# EasyEDA Pro project ProProject_Hauptplatine_ESP32.epro, schematic Schematic1_kombi
Create Date: 2024-06-13; Page Name: P1; Project Name: Hauptplatine_ESP32; Schematic Name: Schematic1_kombi; Update Date: 2024-06-16; Company: EasyEDA.com; Drawn: EasyEDA; Page Size: A4; Part Number: JLCPCB-002; Reviewed: EasyEDA; Version: V0.1
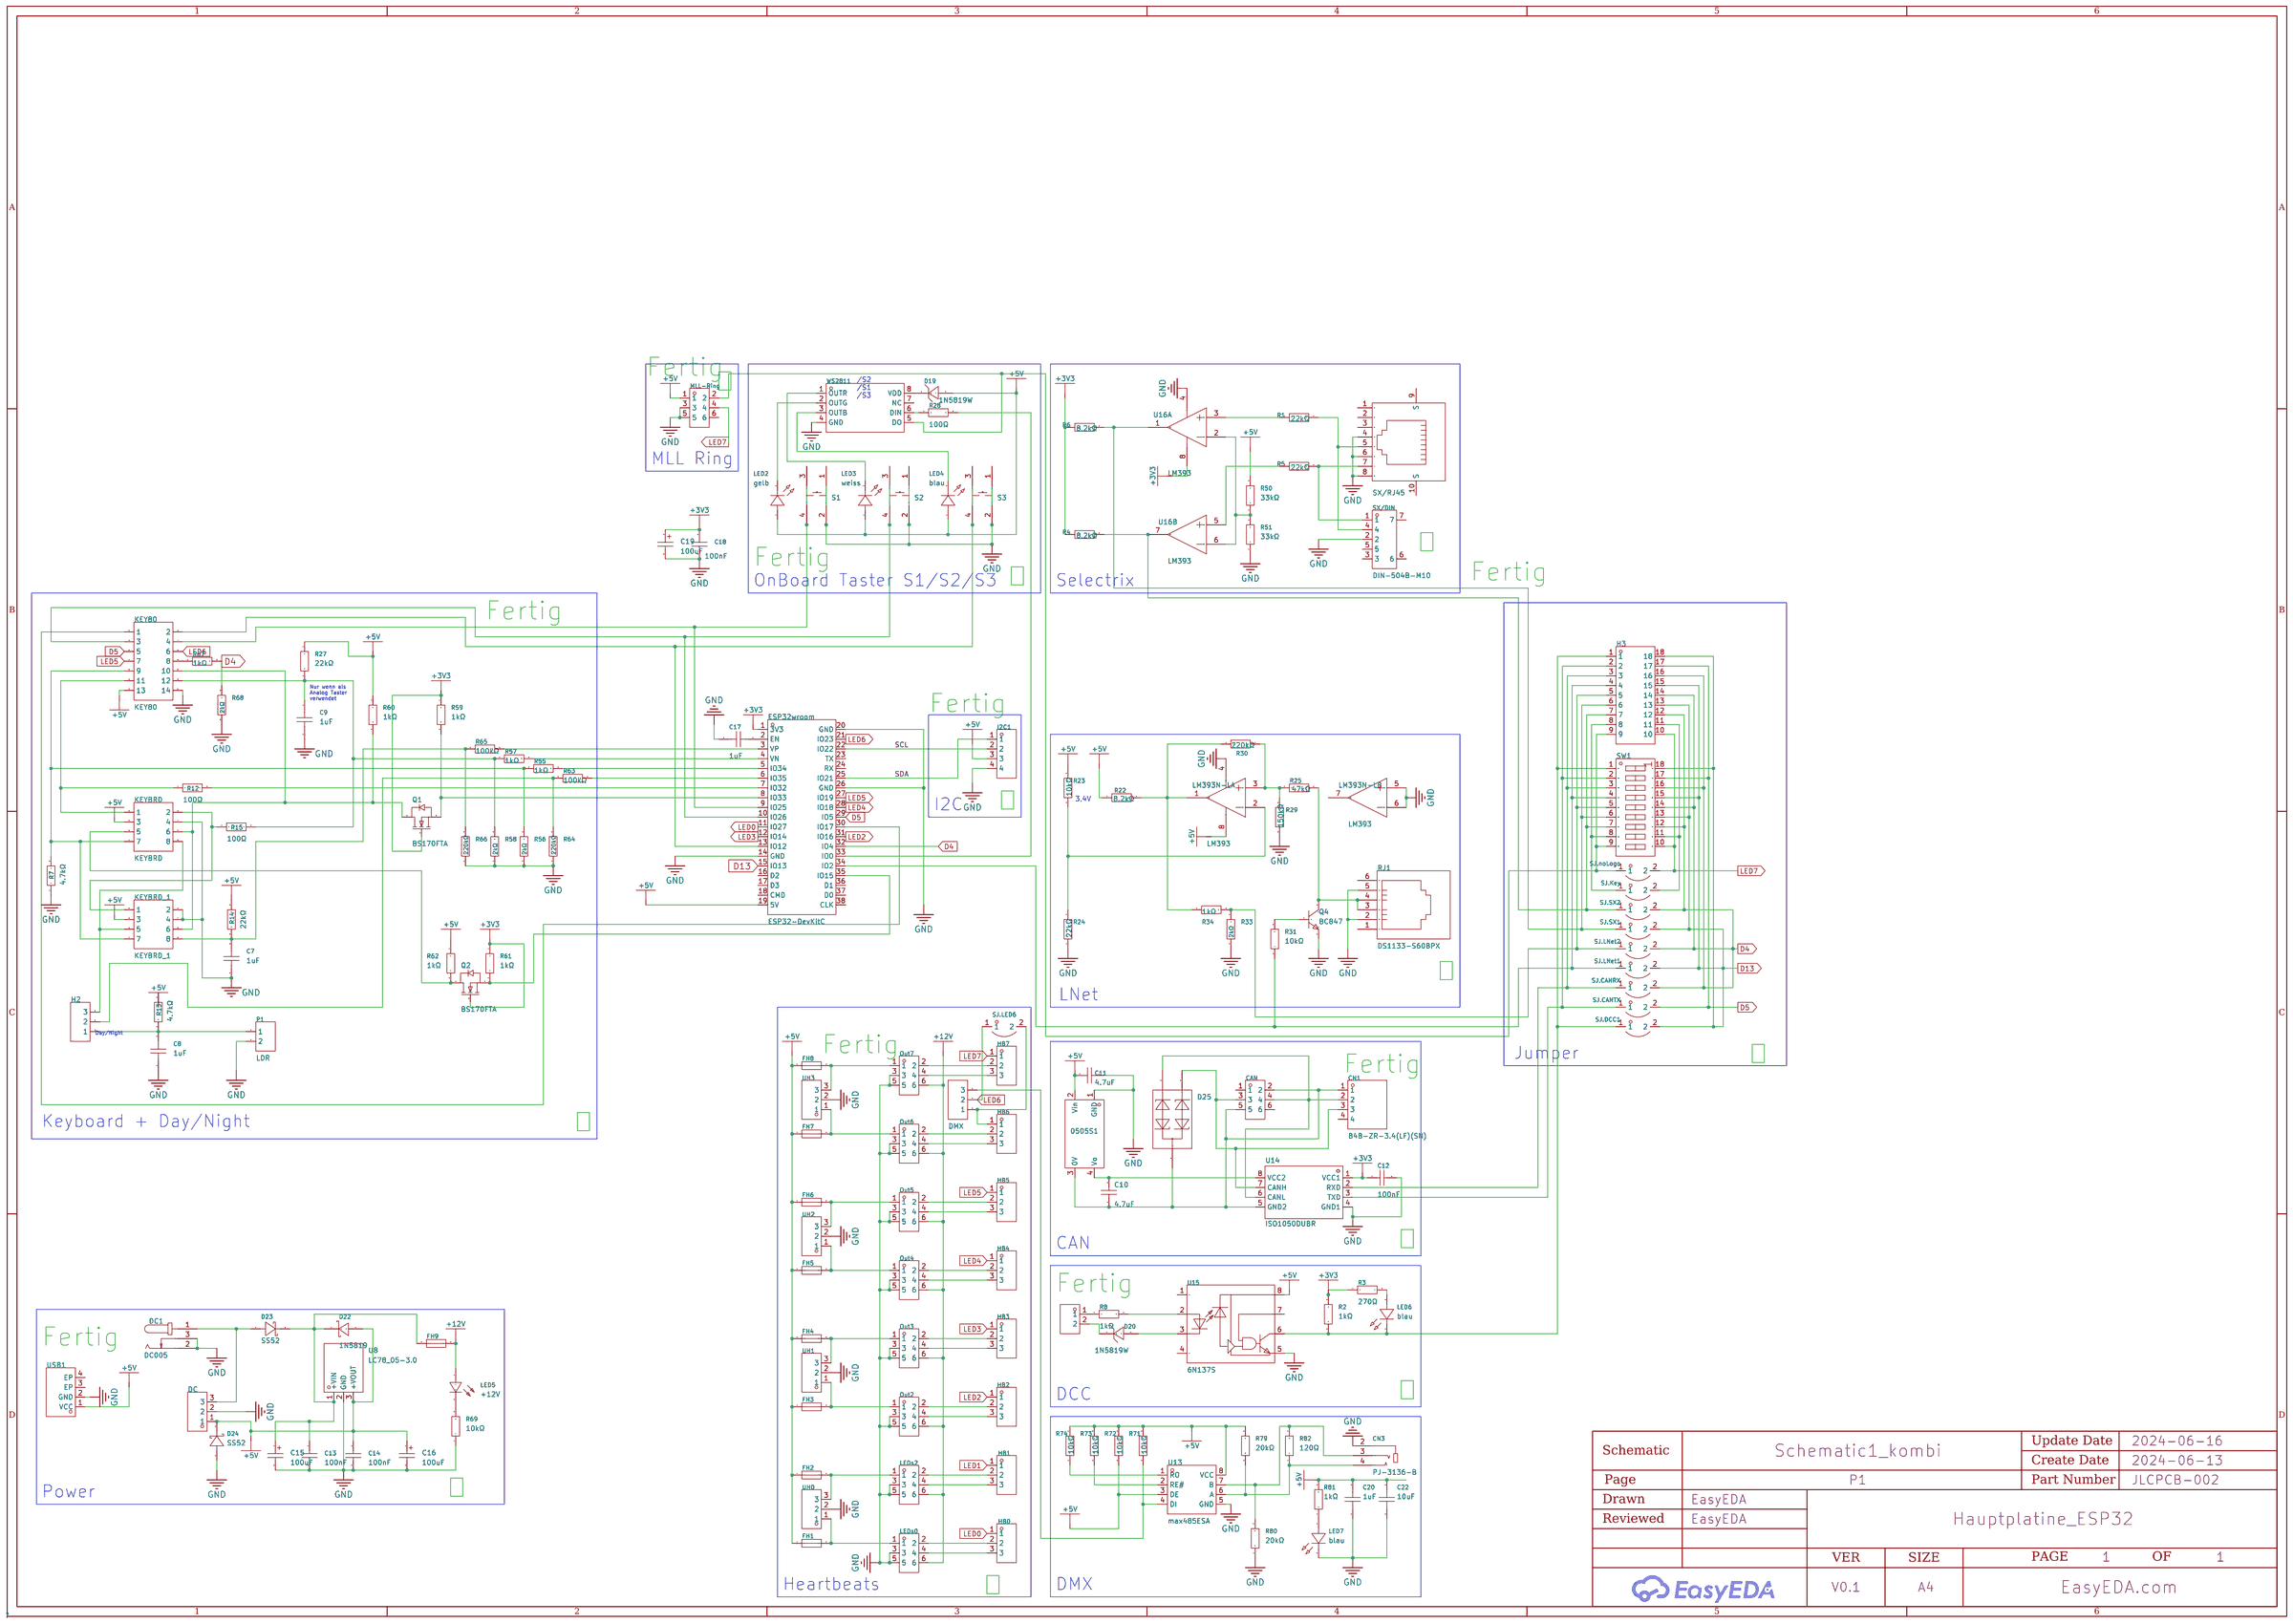
[diagram p5: schematic sheet]

## Parts
0505S1  B0505S-W5R3  [PWRM-TH_BXXXXS-1WR3]
C7  1uF  [C1206]
C8  1uF  [C1206]
C9  1uF  [C1206]
C10  4.7uF  [C1206]
C11  4.7uF  [C1206]
C12  100nF  [C1206]
C13  100nF  [C1206]
C14  100nF  [C1206]
C15  100uF  [CASE-D_7343]
C16  100uF  [CAP-SMD_L3.5-W2.8-R-RD]
C17  1uF  [C1206]
C18  100nF  [C1206]
C19  100uF  [CAP-SMD_L3.5-W2.8-R-RD]
C20  1uF  [C1206]
C22  10uF  [C1206]
CAN  BH254V-6P  [IDC-TH_6P-P2.54-V-R2-C3-S2.54]
CN1  B4B-ZR-3.4(LF)(SN)  [CONN-TH_B4B-ZR-3.4-LF-SN]
CN3  PJ-3136-B  [AUDIO-TH_PJ-3136-B]
D19  1N5819W  [SOD-123_L2.8-W1.8-LS3.7-RD]
D20  1N5819W  [SOD-123_L2.8-W1.8-LS3.7-RD]
D22  1N5819  [SMA_L4.4-W2.6-LS5.0-RD]
D23  SS52  [SMA_L4.3-W2.6-LS5.1-R-RD]
D24  SS52  [SMA_L4.3-W2.6-LS5.1-R-RD]
D25  PESD2CAN,215  [SOT-23-3_L2.9-W1.3-P1.90-LS2.4-BR]
DC  DB2ERC-3.5-3P-GN  [CONN-TH_3P-P3.50_DB2ERC-3.5-3P-GN]
DC1  DC005  [DC-IN-TH_DC005]
DCC1  DB2ERC-3.5-2P-GN  [CONN-TH_2P-P3.50_DB2ERC-3.5-2P]
DMX  2.54-1*3P针  [HDR-TH_3P-P2.54-V-M-1]
ESP32wroom  ESP32-DevKitC  [BULETM-SMD_ESP32-DEVKITC]
FH1  01550900M  [FUSE-SMD_L9.8-W5.0]
FH2  01550900M  [FUSE-SMD_L9.8-W5.0]
FH3  01550900M  [FUSE-SMD_L9.8-W5.0]
FH4  01550900M  [FUSE-SMD_L9.8-W5.0]
FH5  01550900M  [FUSE-SMD_L9.8-W5.0]
FH6  01550900M  [FUSE-SMD_L9.8-W5.0]
FH7  01550900M  [FUSE-SMD_L9.8-W5.0]
FH8  01550900M  [FUSE-SMD_L9.8-W5.0]
FH9  01550900M  [FUSE-SMD_L9.8-W5.0]
H2  2.54-1*3P针  [HDR-TH_3P-P2.54-V-M-1]
H3  X6521WV-2x09H-C60D30  [HDR-TH_18P-P2.54-V-M-R2-C9-S2.54]
HB0  PM2.54-1*3  [HDR-TH_3P-P2.54-V-F]
HB1  PM2.54-1*3  [HDR-TH_3P-P2.54-V-F]
HB2  PM2.54-1*3  [HDR-TH_3P-P2.54-V-F]
HB3  PM2.54-1*3  [HDR-TH_3P-P2.54-V-F]
HB4  PM2.54-1*3  [HDR-TH_3P-P2.54-V-F]
HB5  PM2.54-1*3  [HDR-TH_3P-P2.54-V-F]
HB6  PM2.54-1*3  [HDR-TH_3P-P2.54-V-F]
HB7  PM2.54-1*3  [HDR-TH_3P-P2.54-V-F]
I2C1  2.54-1*4P母  [HDR-TH_4P-P2.54-V-F]
KEY80  KEY80  [IDC-TH_14P-P2.54-V-R2-C7-S2.54]
KEYBRD  KEYBRD  [IDC-TH_8P-P2.54-V-R2-C4-S2.54]
KEYBRD_1  KEYBRD_1  [IDC-TH_8P-P2.54-V-R2-C4-S2.54]
LED2  gelb  [LED-TH_BD3.0-P2.54-FD_YELLOW]
LED3  weiss  [LED-TH_BD3.8-P2.54-FD_WHITE]
LED4  blau  [LED-TH_BD3.8-P2.54-FD_BLUE]
LED5  +12V  [LED-TH_BD3.0-P2.54-FD-GREEN]
LED6  blau  [LED-TH_BD3.8-P2.54-FD_BLUE]
LED7  blau  [LED-TH_BD3.8-P2.54-FD_BLUE]
LEDs0  BH254V-6P  [IDC-TH_6P-P2.54-V-R2-C3-S2.54]
LEDs2  BH254V-6P  [IDC-TH_6P-P2.54-V-R2-C3-S2.54]
LM393N-L  LM393  [SOP-8_L4.9-W3.9-P1.27-LS6.0-BL]  (sections 1,2)
MLL-Ring  BH254V-6P  [IDC-TH_6P-P2.54-V-R2-C3-S2.54]
Out2  BH254V-6P  [IDC-TH_6P-P2.54-V-R2-C3-S2.54]
Out3  BH254V-6P  [IDC-TH_6P-P2.54-V-R2-C3-S2.54]
Out4  BH254V-6P  [IDC-TH_6P-P2.54-V-R2-C3-S2.54]
Out5  BH254V-6P  [IDC-TH_6P-P2.54-V-R2-C3-S2.54]
Out6  BH254V-6P  [IDC-TH_6P-P2.54-V-R2-C3-S2.54]
Out7  BH254V-6P  [IDC-TH_6P-P2.54-V-R2-C3-S2.54]
P1  LDR  [HDR-TH_2P-P2.54-V-F]
Q1  BS170FTA  [SOT-23_L2.9-W1.3-P1.90-LS2.4-BR]
Q2  BS170FTA  [SOT-23_L2.9-W1.3-P1.90-LS2.4-BR]
Q4  BC847  [SOT-23-3_L2.9-W1.3-P1.90-LS2.4-BR]
R1  22kΩ  [R1206]
R2  1kΩ  [R1206]
R3  270Ω  [R1206]
R4  8.2kΩ  [R1206]
R5  22kΩ  [R1206]
R6  8.2kΩ  [R1206]
R7  4.7kΩ  [R1206]
R8  1kΩ  [R1206]
R12  100Ω  [R1206]
R13  4.7kΩ  [R1206]
R14  22kΩ  [R1206]
R15  100Ω  [R1206]
R22  8.2kΩ  [R1206]
R23  10kΩ  [R1206]
R24  22kΩ  [R1206]
R25  47kΩ  [R1206]
R27  22kΩ  [R1206]
R28  100Ω  [R1206]
R29  150kΩ  [R1206]
R30  220kΩ  [R1206]
R31  10kΩ  [R1206]
R33  2kΩ  [R1206]
R34  1kΩ  [R1206]
R50  33kΩ  [R1206]
R51  33kΩ  [R1206]
R55  1kΩ  [R1206]
R56  2kΩ  [R1206]
R57  1kΩ  [R1206]
R58  2kΩ  [R1206]
R59  1kΩ  [R1206]
R60  1kΩ  [R1206]
R61  1kΩ  [R1206]
R62  1kΩ  [R1206]
R63  100kΩ  [R1206]
R64  220kΩ  [R1206]
R65  100kΩ  [R1206]
R66  220kΩ  [R1206]
R67  1kΩ  [R1206]
R68  2kΩ  [R1206]
R69  10kΩ  [R1206]
R71  10kΩ  [R1206]
R72  10kΩ  [R1206]
R73  10kΩ  [R1206]
R74  10kΩ  [R1206]
R79  20kΩ  [R1206]
R80  20kΩ  [R1206]
R81  1kΩ  [R1206]
R82  120Ω  [R1206]
RJ1  DS1133-S60BPX  [RJ11-TH_DS1133-S60BPX]
S1  K2-1102DP-X4SW-04  [KEY-TH_4P-L6.2-W6.2-P4.50-LS6.5]
S2  K2-1102DP-X4SW-04  [KEY-TH_4P-L6.2-W6.2-P4.50-LS6.5]
S3  K2-1102DP-X4SW-04  [KEY-TH_4P-L6.2-W6.2-P4.50-LS6.5]
SJ.CANRX  SJ_1.27  [SMD_2P-P1.27-SJ]
SJ.CANTX  SJ_1.27  [SMD_2P-P1.27-SJ]
SJ.DCC1  SJ_1.27  [SMD_2P-P1.27-SJ]
SJ.Key  SJ_1.27  [SMD_2P-P1.27-SJ]
SJ.LED6  SJ_1.27  [SMD_2P-P1.27-SJ]
SJ.LNet1  SJ_1.27  [SMD_2P-P1.27-SJ]
SJ.LNet2  SJ_1.27  [SMD_2P-P1.27-SJ]
SJ.noLogo  SJ_1.27  [SMD_2P-P1.27-SJ]
SJ.SX1  SJ_1.27  [SMD_2P-P1.27-SJ]
SJ.SX2  SJ_1.27  [SMD_2P-P1.27-SJ]
SW1  DS-09RP  [SW-TH_18P-L24.4-W9.9-P2.54-LS7.6]
SX/DIN  DIN-504B-M10  [CONN-TH_DIN-504B-M10]
SX/RJ45  R-RJ45R08P-B000  [RJ45-TH_R-RJ45R08P-B000]
U8  LC78_05-3.0  [PWRM-TH_LC78_05-3.0]
U13  max485ESA  [SOP-8_L4.9-W3.9-P1.27-LS6.0-BL]
U14  ISO1050DUBR  [SOIC-8_L9.3-W6.6-P2.54-LS10.4-BL]
U15  6N137S  [SOP-8_L9.8-W6.6-P2.54-LS10.3-BL]
U16  LM393  [SOP-8_L4.9-W3.9-P1.27-LS6.0-BL]  (sections 1,2)
UH0  PM2.54-1*3  [HDR-TH_3P-P2.54-V-F]
UH1  PM2.54-1*3  [HDR-TH_3P-P2.54-V-F]
UH2  PM2.54-1*3  [HDR-TH_3P-P2.54-V-F]
UH3  PM2.54-1*3  [HDR-TH_3P-P2.54-V-F]
USB1  KH-TYPE-C-2P  [USB-SMD_KH-TYPE-C-2P]
WS2811  WS2811  [SOP-8_L4.9-W3.9-P1.27-LS6.0-BL]

## Library data of the parts
0505S1 = B0505S-W5R3: Conversion Type:DC-DC Input Voltage(DC):5V Input Voltage(DC):5V Output Voltage:5V Output Voltage:5V Output Power:0.5W Output Current (Max):100mA Output Current (Max):100mA Isolation or not:隔离 Output Channel:1 Insulated Voltage:1500V Conversion Efficiency:; LCSC Part Name: 电源模块; Supplier Part: C882275; Manufacturer: VISOM; Supplier Footprint: 插件; JLCPCB Part Class: Extended Part; Datasheet: https://atta.szlcsc.com/upload/public/pdf/source/20201103/C882275_F211E11AECA51B401D8F665BA96E9160.pdf; Supplier: LCSC; Conversion Type: DC-DC; Input Voltage(DC): 5V; Output Voltage: 5V; Output Power: 0.5W; Output Current (Max): 100mA; Isolation or not: 隔离; Output Channel: 1; Insulated Voltage: 1500V; Conversion Efficiency: 80%; Feature: Short-Circuit Protection; Maximum Capacitive Load: 220uF
C7-C9 C17 = CL31B105KCHNNNE: Capacitance: Tolerance:±10% Tolerance:±10% Voltage Rated: Temperature Coefficient:; LCSC Part Name: 1uF ±10% 100V; Supplier Part: C13832; Manufacturer: SAMSUNG(三星); Supplier Footprint: 1206; JLCPCB Part Class: Extended Part; Datasheet: https://atta.szlcsc.com/upload/public/pdf/source/20160218/1457707763339.pdf; Supplier: LCSC; Tolerance: ±10%
C10 C11 = CL31B475KAHNNNE: Capacitance: Tolerance:±10% Tolerance:±10% Voltage Rated: Temperature Coefficient:; LCSC Part Name: 4.7uF ±10% 25V; Supplier Part: C1872; Manufacturer: SAMSUNG(三星); Supplier Footprint: 1206; JLCPCB Part Class: Extended Part; Datasheet: https://atta.szlcsc.com/upload/public/pdf/source/20160218/1457707763339.pdf; Supplier: LCSC; Tolerance: ±10%
C12 = CC1206KKX7R0BB104: Capacitance: Tolerance:±10% Tolerance:±10% Voltage Rated: Temperature Coefficient:; LCSC Part Name: 100nF ±10% 100V; Supplier Part: C107181; Manufacturer: YAGEO(国巨); Supplier Footprint: 1206; JLCPCB Part Class: Extended Part; Datasheet: https://atta.szlcsc.com/upload/public/pdf/source/20180906/C282243_51A53A5345E69C6665D4E8CFC2B98E68.pdf; Supplier: LCSC; Tolerance: ±10%
C13 C14 C18 = CL31B104KBCNNNC: Capacitance: Tolerance:±10% Tolerance:±10% Voltage Rated: Temperature Coefficient:; LCSC Part Name: 100nF ±10% 50V; Supplier Part: C24497; Manufacturer: SAMSUNG(三星); Supplier Footprint: 1206; JLCPCB Part Class: Basic Part; Datasheet: https://atta.szlcsc.com/upload/public/pdf/source/20160218/1457707763339.pdf; Supplier: LCSC; Tolerance: ±10%
C15 = TAJD107K016RNJ: Capacitance: Tolerance:±10% Tolerance:±10% Rated Voltage: Equivalent Series Resistance(ESR):600mΩ@100kHz Operating Temperature:-55℃~+125℃ Operating Temperature:-55℃~+125℃; LCSC Part Name: 100uF ±10% 16V; Supplier Part: C7223; Manufacturer: Kyocera AVX; Supplier Footprint: CASE-D-7343; JLCPCB Part Class: Extended Part; Datasheet: https://atta.szlcsc.com/upload/public/pdf/source/20160107/1457707750344.pdf; Supplier: LCSC; Tolerance: ±10%; Equivalent Series Resistance(ESR): 600mΩ@100kHz; Operating Temperature: -55℃~+125℃
C16 C19 = TAJB107M006RNJ: Capacitance: Tolerance:±20% Tolerance:±20% Rated Voltage: Equivalent Series Resistance(ESR):1.7Ω@100kHz Operating Temperature:-55℃~+125℃ Operating Temperature:-55℃~+125℃; LCSC Part Name: 100uF ±20% 6.3V; Supplier Part: C7195; Manufacturer: Kyocera AVX; Supplier Footprint: CASE-B-3528; JLCPCB Part Class: Extended Part; Datasheet: https://atta.szlcsc.com/upload/public/pdf/source/20160107/1457707750344.pdf; Supplier: LCSC; Tolerance: ±20%; Equivalent Series Resistance(ESR): 1.7Ω@100kHz; Operating Temperature: -55℃~+125℃
C20 = CL31B105KBHNNNE: Capacitance: Tolerance:±10% Tolerance:±10% Voltage Rated: Temperature Coefficient:; LCSC Part Name: 1uF ±10% 50V; Supplier Part: C1848; Manufacturer: SAMSUNG(三星); Supplier Footprint: 1206; JLCPCB Part Class: Basic Part; Datasheet: https://atta.szlcsc.com/upload/public/pdf/source/20160218/1457707763339.pdf; Supplier: LCSC; Tolerance: ±10%
C22 = CL31B106KBHNNNE: Capacitance: Tolerance:±10% Tolerance:±10% Voltage Rated: Temperature Coefficient:; LCSC Part Name: 10uF ±10% 50V; Supplier Part: C89632; Manufacturer: SAMSUNG(三星); Supplier Footprint: 1206; JLCPCB Part Class: Extended Part; Datasheet: https://atta.szlcsc.com/upload/public/pdf/source/20161130/1480498807789.pdf; Supplier: LCSC; Tolerance: ±10%
CAN LEDs0 LEDs2 MLL-Ring Out2-Out7 = BH254V-6P: Connector Type:简牛座 Pitch:2.54mm Structure:2x3P Current Rating (Max):3A Voltage Rating (Max):250V Holder Type:Straight Row Spacing:2.54mm Number of Rows:2 Pin Number in each Row:3 Operating Temperature Range:-40℃~+105℃ Operating Temperature Range:-40℃~+105; LCSC Part Name: 2.54mm 2x3P 排数:2 每排P数:3; Supplier Part: C492441; Manufacturer: XFCN(兴飞); Supplier Footprint: 插件,P=2.54mm; JLCPCB Part Class: Extended Part; Datasheet: https://atta.szlcsc.com/upload/public/pdf/source/20200312/C492444_4AABE2FC4F6BE8226B85135616AF0092.pdf; Supplier: LCSC; Connector Type: 简牛座; Pitch: 2.54mm; Structure: 2x3P; Current Rating (Max): 3A; Voltage Rating (Max): 250V; Holder Type: Straight; Row Spacing: 2.54mm; Number of Rows: 2; Pin Number in each Row: 3; Operating Temperature Range: -40℃~+105℃
CN1 = B4B-ZR-3.4(LF)(SN): Pins Structure:1x4P Pitch:1.5mm Mounting Style:- Reference Series:ZH Number of Pins:4P Number of Rows:1 Number of PINs Per Row:4 Row Spacing:- Contact Material:Brass; LCSC Part Name: 系列:ZH 间距:1.5mm 1x4P; Supplier Part: C163034; Manufacturer: JST; Supplier Footprint: 插件,P=1.5mm; JLCPCB Part Class: Extended Part; Datasheet: https://atta.szlcsc.com/upload/public/pdf/source/20180323/39B5D59EC26DA232EF7FD531DD84146D.pdf; Supplier: LCSC; Pins Structure: 1x4P; Pitch: 1.5mm; Reference Series: ZH; Number of Pins: 4P; Number of Rows: 1; Number of PINs Per Row: 4; Contact Material: Brass
CN3 = PJ-3136-B: Connector Type:3.5mm耳机座 Current Rating (Max):500mA Voltage Rating (Max):30V Contact Material:- Contact Plating:- Operating Temperature Range:-20℃~+70℃ Operating Temperature Range:-20℃~+70℃ Soldering Temperature(Max):235℃; LCSC Part Name: 3.5mm耳机座; Supplier Part: C381131; Manufacturer: XKB Connectivity(中国星坤); Supplier Footprint: 插件; JLCPCB Part Class: Extended Part; Datasheet: https://atta.szlcsc.com/upload/public/pdf/source/20231101/FB45AABFD04C0979FDEE8A028D0B6336.pdf; Supplier: LCSC; Connector Type: 3.5mm耳机座; Current Rating (Max): 500mA; Voltage Rating (Max): 30V; Operating Temperature Range: -20℃~+70℃; Soldering Temperature(Max): 235℃
D19 D20 = 1N5819W_C402219: Forward Voltage (Vf@If):900mV@3A Reverse Voltage (Vr):40V Average Rectified Current (Io):1A; LCSC Part Name: 电压:40V 电流:1A; Supplier Part: C402219; Manufacturer: LGE(鲁光); Supplier Footprint: SOD-123; JLCPCB Part Class: Extended Part; Datasheet: https://atta.szlcsc.com/upload/public/pdf/source/20190705/C402219_2009EA3D7FB00C8B1236866A0C573AC9.pdf; Supplier: LCSC; Forward Voltage (Vf@If): 900mV@3A; Reverse Voltage (Vr): 40V; Average Rectified Current (Io): 1A
D22 = 1N5819_C437199: Forward Voltage (Vf@If):500mV@1A Reverse Voltage (Vr):40V Average Rectified Current (Io):1A; LCSC Part Name: 电压:40V 电流:1A; Supplier Part: C437199; Manufacturer: KEXIN(科信); Supplier Footprint: DO-214AC(SMA); JLCPCB Part Class: Extended Part; Datasheet: https://atta.szlcsc.com/upload/public/pdf/source/20191012/C437199_83583E622A6684E767605E43C169C596.pdf; Supplier: LCSC; Forward Voltage (Vf@If): 500mV@1A; Reverse Voltage (Vr): 40V; Average Rectified Current (Io): 1A
D23 D24 = SS52_C727064: Diode Configuration:Single Forward Voltage (Vf@If):550mV@5A Reverse Voltage (Vr):20V Average Rectified Current (Io):5A Reverse Leakage Current (Ir):500uA@20V; LCSC Part Name: 电压:20V 电流:5A; Supplier Part: C727064; Manufacturer: TWGMC(台湾迪嘉); Supplier Footprint: SMA(DO-214AC); JLCPCB Part Class: Extended Part; Datasheet: https://atta.szlcsc.com/upload/public/pdf/source/20200828/C727064_BD0A2B36CBC76CEA4B6710C57718D41F.pdf; Supplier: LCSC; Diode Configuration: Single; Forward Voltage (Vf@If): 550mV@5A; Reverse Voltage (Vr): 20V; Average Rectified Current (Io): 5A; Reverse Leakage Current (Ir): 500uA@20V
D25 = PESD2CAN,215: polarity:Bi-Directional Reverse Stand-Off Voltage (Vrwm):24V Maximum Clamping Voltage:41V Peak Pulse Current (Ipp)@10/1000us:5A Peak Pulse Power Dissipation (Ppp)@10/1000us:230W Breakdown Voltage:26.2V Number of Lines:双路 Operating Temperature:-55℃~+150℃@(; LCSC Part Name: 双向ESD; Supplier Part: C75176; Manufacturer: Nexperia(安世); Supplier Footprint: SOT-23; JLCPCB Part Class: Extended Part; Datasheet: https://atta.szlcsc.com/upload/public/pdf/source/20170505/1493951386298.pdf; Supplier: LCSC; polarity: Bi-Directional; Reverse Stand-Off Voltage (Vrwm): 24V; Maximum Clamping Voltage: 41V; Peak Pulse Current (Ipp)@10/1000us: 5A; Peak Pulse Power Dissipation (Ppp)@10/1000us: 230W; Breakdown Voltage: 26.2V; Number of Lines: 双路; Operating Temperature: -55℃~+150℃@(Ta); Type: ESD
DC = DB2ERC-3.5-3P-GN: Connector Type:板端/Receptacle-Close Structure:1x3P Pitch:3.5mm Color:Green Mounting Style:Bend Number of Pins:3P Number of Rows:1 Number of PINs Per Row:3 Current Rating (Max):10A Voltage Rating (Max):250V Operating Temperature Range:-40℃~+105℃ Operating T; LCSC Part Name: 3.5mm 1x3P 排数:1 每排P数:3; Supplier Part: C430551; Manufacturer: DORABO(地博电气); Supplier Footprint: 弯插,P=3.5mm; JLCPCB Part Class: Extended Part; Datasheet: https://atta.szlcsc.com/upload/public/pdf/source/20190923/C430575_06246F5F3B4A2DABA2F1121ECAE9A082.pdf; Supplier: LCSC; Connector Type: 板端/Receptacle-Close; Structure: 1x3P; Pitch: 3.5mm; Color: Green; Mounting Style: Bend; Number of Pins: 3P; Number of Rows: 1; Number of PINs Per Row: 3; Current Rating (Max): 10A; Voltage Rating (Max): 250V; Operating Temperature Range: -40℃~+105℃
DC1 = DC005: Connector Type:DC Power Receptacle Mounting Style:Right-Angle Inside Contact Diameter:2mm Outside Contact Diameter:6.3mm Current Rating (Max):500mA Voltage Rating (Max):30V Operating Temperature Range:-40℃~+55℃ Operating Temperature Range:-40℃~+55℃; LCSC Part Name: DC电源插座 内径:2mm 外径:6.3mm; Supplier Part: C431533; Manufacturer: SHOU HAN(首韩); Supplier Footprint: 插件; JLCPCB Part Class: Extended Part; Datasheet: https://atta.szlcsc.com/upload/public/pdf/source/20190925/C431533_4751811035784AC1D38EBC85F7905E99.pdf; Supplier: LCSC; Connector Type: DC Power Receptacle; Mounting Style: Right-Angle; Inside Contact Diameter: 2mm; Outside Contact Diameter: 6.3mm; Current Rating (Max): 500mA; Voltage Rating (Max): 30V; Operating Temperature Range: -40℃~+55℃
DCC1 = DB2ERC-3.5-2P-GN: Connector Type:板端/Receptacle-Close Pitch:3.5mm Structure:1x2P Number of Rows:1 Number of PINs Per Row:2 Number of Pins:2P Current Rating (Max):10A Voltage Rating (Max):250V Operating Temperature Range:-40℃~+105℃ Operating Temperature Range:-40℃~+105℃ Colo; LCSC Part Name: 3.5mm 1x2P 排数:1 每排P数:2; Supplier Part: C395830; Manufacturer: DIBO(地博电气); Supplier Footprint: 弯插,P=3.5mm; JLCPCB Part Class: Extended Part; Datasheet: https://atta.szlcsc.com/upload/public/pdf/source/20230327/B3D6220F4540DBC069FF6ECCFA34901A.pdf; Supplier: LCSC; Connector Type: 板端/Receptacle-Close; Pitch: 3.5mm; Structure: 1x2P; Number of Rows: 1; Number of PINs Per Row: 2; Number of Pins: 2P; Current Rating (Max): 10A; Voltage Rating (Max): 250V; Operating Temperature Range: -40℃~+105℃; Color: Green; Mounting Style: Bend
DMX H2 = 2.54-1*3P针: Pin Structure:1x3P Pitch:2.54mm Row Spacing:- Circluar Pins/Square Pins:Square Pins Mounting Type:Straight Number of Rows:Plugin Number of Pins:3P Current Rating (Max):3A Voltage Rating (Max):- Length of Mating Pin:- Insulation Height:- Length of End Conn; LCSC Part Name: 间距:2.54mm 1x3P 直插 方针; Supplier Part: C49257; Manufacturer: BOOMELE(博穆精密); Supplier Footprint: 插件,P=2.54mm; JLCPCB Part Class: Extended Part; Datasheet: https://atta.szlcsc.com/upload/public/pdf/source/20221018/3E9408392E35E6F57A28985E5F7BF5C9.pdf; Supplier: LCSC; Pin Structure: 1x3P; Pitch: 2.54mm; Circluar Pins/Square Pins: Square Pins; Mounting Type: Straight; Number of Rows: Plugin; Number of Pins: 3P; Current Rating (Max): 3A; Operating Temperature Range: -40℃~+105℃; Color: Black
ESP32wroom = ESP32-DevKitC: CPU:- ROM Size:- Number of I/O: USB:- WIFI Protocols:- Bluetooth:- Ethernet:- Audio & Video Interface:- Multimedia Support:- Card Type:- Power Supply Type:- Power Supply:- POE Support:- Resolution:- Temperature Range:-; LCSC Part Name: 开发板; Supplier Part: C571180; Manufacturer: ESPRESSIF(乐鑫); JLCPCB Part Class: Extended Part; Datasheet: https://atta.szlcsc.com/upload/public/pdf/source/20200521/C529586_D6FCDAFCFF160B3EDDF7DF28D600699D.pdf; Supplier: LCSC
FH1-FH9 = 01550900M: Fuseholder Type:- Fuse Type:- Fuse Size:-; Supplier Part: C108518; Manufacturer: Littelfuse(美国力特); Supplier Footprint: SMD,5.0x9.7mm; JLCPCB Part Class: Extended Part; Datasheet: https://atta.szlcsc.com/upload/public/pdf/source/20181031/C315847_D8C8759CD5ED576C0EA975A2D5312378.pdf; Supplier: LCSC
H3 = X6521WV-2x09H-C60D30: Pin Structure:2x9P Pitch:2.54mm Row Spacing:2.54mm Circluar Pins/Square Pins:Square Pins Mounting Type:- Number of Rows:双排 Number of Pins:18P Current Rating (Max):3A Voltage Rating (Max):250V Length of Mating Pin:6mm Insulation Height:2.5mm Length of End; LCSC Part Name: 2x9P 间距:2.54mm 方针; Supplier Part: C706899; Manufacturer: XKB Connection(中国星坤); Supplier Footprint: 插件,P=2.54mm; JLCPCB Part Class: Extended Part; Datasheet: https://atta.szlcsc.com/upload/public/pdf/source/20211009/DE33EBA4104B5B447A7BD8383FBBA145.pdf; Supplier: LCSC; Pin Structure: 2x9P; Pitch: 2.54mm; Row Spacing: 2.54mm; Circluar Pins/Square Pins: Square Pins; Number of Rows: 双排; Number of Pins: 18P; Current Rating (Max): 3A; Voltage Rating (Max): 250V; Length of Mating Pin: 6mm; Insulation Height: 2.5mm; Length of End Connection Pin: 3mm; Contact Plating: Gold; Operating Temperature Range: -40℃~+105℃; Soldering Temperature(Max): 260℃; Color: Black
HB0-HB7 UH0-UH3 = PM2.54-1*3: Holes Structure:1x3P Pitch:2.54mm Row Spacing:2.54mm Circular Hole / Square Hole:方孔 Mounting Type:Straight Number of Rows:Plugin Number of Holes:3P Current Rating (Max):2.5A Holes Direction:Top Insulation Height:8.5mm Operating Temperature Range:-40℃~+105; LCSC Part Name: 间距:2.54mm 1x3P 直插; Supplier Part: C5116529; Manufacturer: ZHOURI(洲日); Supplier Footprint: 插件,P=2.54mm; JLCPCB Part Class: Extended Part; Datasheet: https://atta.szlcsc.com/upload/public/pdf/source/20220729/0B9CDCB2053AD78CED9CDFEF888323E9.pdf; Supplier: LCSC; Holes Structure: 1x3P; Pitch: 2.54mm; Row Spacing: 2.54mm; Circular Hole / Square Hole: 方孔; Mounting Type: Straight; Number of Rows: Plugin; Number of Holes: 3P; Current Rating (Max): 2.5A; Holes Direction: Top; Insulation Height: 8.5mm; Operating Temperature Range: -40℃~+105℃
I2C1 = 2.54-1*4P母: Holes Structure:1x4P Pitch:2.54mm Row Spacing:- Circular Hole / Square Hole:Square Holes Mounting Type:Straight Number of Rows:Plugin Number of Holes:4P Current Rating (Max):3A Voltage Rating (Max):- Holes Direction:Top Insulation Height:- Contact Materia; LCSC Part Name: 间距:2.54mm 1x4P 直插; Supplier Part: C2718488; Manufacturer: BOOMELE(博穆精密); Supplier Footprint: 插件,P=2.54mm; JLCPCB Part Class: Extended Part; Datasheet: https://atta.szlcsc.com/upload/public/pdf/source/20210301/C2718488_F4427B881E42CAA8DDB0B1C12B3A522C.pdf; Supplier: LCSC; Holes Structure: 1x4P; Pitch: 2.54mm; Circular Hole / Square Hole: Square Holes; Mounting Type: Straight; Number of Rows: Plugin; Number of Holes: 4P; Current Rating (Max): 3A; Holes Direction: Top; Contact Material: bronze; Operating Temperature Range: -40℃~+105℃
KEY80 = 2.54-2*7P简牛: Connector Type:简牛座 Pitch:2.54mm Structure:2x7P Holder Type:Straight Row Spacing:2.54mm Number of Rows:2 Pin Number in each Row:7 Contact Material:Brass Contact Plating:Gold; LCSC Part Name: 2.54mm 2x7P 排数:2 每排P数:7; Supplier Part: C11215; Manufacturer: BOOMELE(博穆精密); Supplier Footprint: 插件,P=2.54mm; JLCPCB Part Class: Extended Part; Datasheet: https://atta.szlcsc.com/upload/public/pdf/source/20131122/1457706661483.pdf; Supplier: LCSC; Connector Type: 简牛座; Pitch: 2.54mm; Structure: 2x7P; Holder Type: Straight; Row Spacing: 2.54mm; Number of Rows: 2; Pin Number in each Row: 7; Contact Material: Brass; Contact Plating: Gold
KEYBRD KEYBRD_1 = 2.54-2*4P简牛: Connector Type:简牛座 Pitch:2.54mm Structure:2x4P Holder Type:Straight Row Spacing:2.54mm Number of Rows:2 Pin Number in each Row:4 Contact Material:- Contact Plating:-; LCSC Part Name: 2.54mm 2x4P 排数:2 每排P数:4; Supplier Part: C9135; Manufacturer: BOOMELE(博穆精密); Supplier Footprint: 插件,P=2.54mm; JLCPCB Part Class: Extended Part; Datasheet: https://atta.szlcsc.com/upload/public/pdf/source/20131122/1457706661483.pdf; Supplier: LCSC; Connector Type: 简牛座; Pitch: 2.54mm; Structure: 2x4P; Holder Type: Straight; Row Spacing: 2.54mm; Number of Rows: 2; Pin Number in each Row: 4
LED2 = TZ-L2-03YYBY2YDJ30-001: Lamp Holder Type:3mm圆形灯头 Emitted Color:Yellow Power Dissipation:60mW Forward Current:20mA Dominant Wavelength:590nm~595nm Dominant Wavelength:590nm~595nm Peak Wavelength:- Diode Configuration:- Lens Color:黄色透镜 Color Temperature:- Color Temperature:- Viewi; LCSC Part Name: 黄灯; Supplier Part: C779430; Manufacturer: TUOZHAN(拓展光电); Supplier Footprint: 插件,D=3mm; JLCPCB Part Class: Extended Part; Datasheet: https://atta.szlcsc.com/upload/public/pdf/source/20200925/C779430_863756D6554513B1EB57F7A850CA2A03.pdf; Supplier: LCSC; Lamp Holder Type: 3mm圆形灯头; Emitted Color: Yellow; Power Dissipation: 60mW; Forward Current: 20mA; Dominant Wavelength: 590nm~595nm; Lens Color: 黄色透镜; Viewing Angle: 30°; Operating Temperature: -20℃~+75℃
LED3 = XL-302UWC: Lamp Holder Type:3mm圆形灯头 Emitted Color:White Power Dissipation:80mW Forward Current:20mA Lens Color:无色透明透镜 Color Temperature:6000K~6500K Color Temperature:6000K~6500K Viewing Angle:50° Mounting Sytle:- Operating Temperature:-25℃~+85℃ Operating Temperature; Supplier Part: C2895458; Manufacturer: XINGLIGHT(成兴光); Supplier Footprint: 插件,D=3mm; JLCPCB Part Class: Extended Part; Datasheet: https://atta.szlcsc.com/upload/public/pdf/source/20240112/543BCCAC3CB93518E6AD22EB07A95060.pdf; Supplier: LCSC; Lamp Holder Type: 3mm圆形灯头; Emitted Color: White; Power Dissipation: 80mW; Forward Current: 20mA; Lens Color: 无色透明透镜; Color Temperature: 6000K~6500K; Viewing Angle: 50°; Operating Temperature: -25℃~+85℃
LED4 LED6 LED7 = XL-302UBD: Lamp Holder Type:3mm圆形灯头 Emitted Color:Blue Power Dissipation:80mW Forward Current:30mA Dominant Wavelength:455nm~460nm Dominant Wavelength:455nm~460nm Peak Wavelength:465nm Lens Color:蓝色透镜 Color Temperature:- Color Temperature:- Viewing Angle:50° Mountin; Supplier Part: C2895474; Manufacturer: XINGLIGHT(成兴光); Supplier Footprint: 插件,D=3mm; JLCPCB Part Class: Extended Part; Datasheet: https://atta.szlcsc.com/upload/public/pdf/source/20240112/D32096FD17ADF843BFE6A9D946368B54.pdf; Supplier: LCSC; Lamp Holder Type: 3mm圆形灯头; Emitted Color: Blue; Power Dissipation: 80mW; Forward Current: 30mA; Dominant Wavelength: 455nm~460nm; Peak Wavelength: 465nm; Lens Color: 蓝色透镜; Viewing Angle: 50°; Operating Temperature: -25℃~+85℃
LED5 = 204-10SUGD/S400-A5: Lamp Holder Type:3mm圆形灯头 Emitted Color:Emerald Power Dissipation:110mW Forward Current:20mA Dominant Wavelength:530nm Dominant Wavelength:530nm Peak Wavelength:525nm Diode Configuration:- Lens Color:雾状绿透镜 Color Temperature:- Color Temperature:- Viewing An; LCSC Part Name: 翠绿; Supplier Part: C99761; Manufacturer: EVERLIGHT(亿光); Supplier Footprint: 插件,D=3mm; JLCPCB Part Class: Extended Part; Datasheet: https://atta.szlcsc.com/upload/public/pdf/source/20231222/11ECFE5D50388BB9885CDCD9350FD859.pdf; Supplier: LCSC; Lamp Holder Type: 3mm圆形灯头; Emitted Color: Emerald; Power Dissipation: 110mW; Forward Current: 20mA; Dominant Wavelength: 530nm; Peak Wavelength: 525nm; Lens Color: 雾状绿透镜; Viewing Angle: 30°; Operating Temperature: -40℃~+85℃
LM393N-L U16 = LM393_1: Supply Voltage:2V~36V Supply Voltage:2V~36V Output Type:- Output Mode:-; LCSC Part Name: Low Power Dual Voltage Comparators; Supplier Part: C2829427; Manufacturer: CJ(江苏长电/长晶); Supplier Footprint: SOP-8; JLCPCB Part Class: Extended Part; Datasheet: https://atta.szlcsc.com/upload/public/pdf/source/20220609/39520EAE1DF2964E7BBDEB2789543562.pdf; Supplier: LCSC; Supply Voltage: 2V~36V
P1 = 2.54-1*2P母: Holes Structure:1x2P Pitch:2.54mm Row Spacing:- Mounting Type:Straight Number of Rows:Plugin Number of Holes:2P Insulation Height:- Contact Material:- Contact Plating:-; LCSC Part Name: 间距:2.54mm 1x2P 直插; Supplier Part: C49661; Manufacturer: BOOMELE(博穆精密); Supplier Footprint: 插件,P=2.54mm; JLCPCB Part Class: Extended Part; Datasheet: https://atta.szlcsc.com/upload/public/pdf/source/20210301/C2718488_F4427B881E42CAA8DDB0B1C12B3A522C.pdf; Supplier: LCSC; Holes Structure: 1x2P; Pitch: 2.54mm; Mounting Type: Straight; Number of Rows: Plugin; Number of Holes: 2P
Q1 Q2 = BS170FTA_C151050: Type:1个NChannel Drain Source Voltage (Vdss): Continuous Drain Current (Id):150uA Power Dissipation (Pd): Drain Source On Resistance (RDS(on)@Vgs,Id):5Ω@10V,200mA Gate Threshold Voltage (Vgs(th)@Id):3V@1mA Input Capacitance (Ciss@Vds):60pF@10V Operating Te; LCSC Part Name: 1个N沟道 耐压:60V 电流:150uA; Supplier Part: C151050; Manufacturer: DIODES(美台); Supplier Footprint: SOT-23; JLCPCB Part Class: Extended Part; Datasheet: https://atta.szlcsc.com/upload/public/pdf/source/20171212/C151050_15130639314811177922.pdf; Supplier: LCSC; Type: 1个NChannel; Continuous Drain Current (Id): 150uA; Drain Source On Resistance (RDS(on)@Vgs,Id): 5Ω@10V,200mA; Gate Threshold Voltage (Vgs(th)@Id): 3V@1mA; Input Capacitance (Ciss@Vds): 60pF@10V; Operating Temperature: -55℃~+150℃@(Tj)
Q4 = BC847_C475630: Transistor Type: Collector Current (Ic): Collector-Emitter Breakdown Voltage (Vceo): Power Dissipation (Pd): DC Current Gain (hFE@Ic,Vce):110@2mA,5V DC Current Gain (hFE@Ic,Vce):110@2mA,5V Transition Frequency (fT):100MHz Collector Cut-Off Current (Icbo):; LCSC Part Name: NPN 电流:100mA 耐压:45V; Supplier Part: C475630; Manufacturer: SHIKUES(时科); Supplier Footprint: SOT-23; JLCPCB Part Class: Extended Part; Datasheet: https://atta.szlcsc.com/upload/public/pdf/source/20200102/C475632_1BD5CEE5FD46587CE970DDC94CF96264.pdf; Supplier: LCSC; DC Current Gain (hFE@Ic,Vce): 110@2mA,5V; Transition Frequency (fT): 100MHz; Collector Cut-Off Current (Icbo): 100nA; Collector-Emitter Saturation Voltage (VCE(sat)@Ic,Ib): 500mV@100mA,5mA
R1 R5 R14 R24 R27 = 1206W4F2202T5E: Type:Thick Film Resistors Resistance:22kΩ Tolerance:±1% Tolerance:±1% Power(Watts): Overload Voltage (Max): Temperature Coefficient:±100ppm/℃ Temperature Coefficient:±100ppm/℃ Operating Temperature Range:-55℃~+155℃ Operating Temperature Range:-55℃~+155℃; LCSC Part Name: 22kΩ ±1% 250mW 厚膜电阻; Supplier Part: C25830; Manufacturer: UNI-ROYAL(厚声); Supplier Footprint: 1206; JLCPCB Part Class: Extended Part; Datasheet: https://atta.szlcsc.com/upload/public/pdf/source/20200306/C422600_1E6D84923E4A46A82E41ADD87F860B5C.pdf; Supplier: LCSC; Type: Thick Film Resistors; Tolerance: ±1%; Temperature Coefficient: ±100ppm/℃; Operating Temperature Range: -55℃~+155℃
R2 R8 R34 R55 R57 R59-R62 R67 R81 = 1206W4F1001T5E_C4410: Resistance:1000Ω Tolerance:±1% Tolerance:±1% Power(Watts): Overload Voltage (Max): Type:Thick Film Resistors Operating Temperature Range:-55℃~+155℃ Operating Temperature Range:-55℃~+155℃; LCSC Part Name: 1kΩ ±1% 250mW 厚膜电阻; Supplier Part: C4410; Manufacturer: UNI-ROYAL(厚声); Manufacturer Part: 1206W4F1001T5E; Supplier Footprint: 1206; JLCPCB Part Class: Basic Part; Datasheet: https://atta.szlcsc.com/upload/public/pdf/source/20200306/C422600_1E6D84923E4A46A82E41ADD87F860B5C.pdf; Supplier: LCSC; Tolerance: ±1%; Type: Thick Film Resistors; Operating Temperature Range: -55℃~+155℃
R3 = 1206W4J0271T5E: Type:Thick Film Resistors Resistance: Tolerance:±5% Tolerance:±5% Power(Watts): Overload Voltage (Max): Temperature Coefficient:±100ppm/℃ Temperature Coefficient:±100ppm/℃ Operating Temperature Range:-55℃~+155℃ Operating Temperature Range:-55℃~+155℃; LCSC Part Name: 270Ω ±5% 250mW 厚膜电阻; Supplier Part: C25366; Manufacturer: UNI-ROYAL(厚声); Supplier Footprint: 1206; JLCPCB Part Class: Extended Part; Datasheet: https://atta.szlcsc.com/upload/public/pdf/source/20200306/C422600_1E6D84923E4A46A82E41ADD87F860B5C.pdf; Supplier: LCSC; Type: Thick Film Resistors; Tolerance: ±5%; Temperature Coefficient: ±100ppm/℃; Operating Temperature Range: -55℃~+155℃
R4 R6 R22 = 1206W4F8201T5E: Type:Thick Film Resistors Resistance:8.2kΩ Tolerance:±1% Tolerance:±1% Power(Watts): Overload Voltage (Max): Temperature Coefficient:±100ppm/℃ Temperature Coefficient:±100ppm/℃ Operating Temperature Range:-55℃~+155℃ Operating Temperature Range:-55℃~+155℃; LCSC Part Name: 8.2kΩ ±1% 250mW 厚膜电阻; Supplier Part: C18027; Manufacturer: UNI-ROYAL(厚声); Supplier Footprint: 1206; JLCPCB Part Class: Extended Part; Datasheet: https://atta.szlcsc.com/upload/public/pdf/source/20200306/C422600_1E6D84923E4A46A82E41ADD87F860B5C.pdf; Supplier: LCSC; Type: Thick Film Resistors; Tolerance: ±1%; Temperature Coefficient: ±100ppm/℃; Operating Temperature Range: -55℃~+155℃
R7 R13 = 1206W4F4701T5E: Type:Thick Film Resistors Resistance:4.7kΩ Tolerance:±1% Tolerance:±1% Power(Watts): Overload Voltage (Max): Temperature Coefficient:±100ppm/℃ Temperature Coefficient:±100ppm/℃ Operating Temperature Range:-55℃~+155℃ Operating Temperature Range:-55℃~+155℃; LCSC Part Name: 4.7kΩ ±1% 250mW 厚膜电阻; Supplier Part: C17936; Manufacturer: UNI-ROYAL(厚声); Supplier Footprint: 1206; JLCPCB Part Class: Basic Part; Datasheet: https://atta.szlcsc.com/upload/public/pdf/source/20200306/C422600_1E6D84923E4A46A82E41ADD87F860B5C.pdf; Supplier: LCSC; Type: Thick Film Resistors; Tolerance: ±1%; Temperature Coefficient: ±100ppm/℃; Operating Temperature Range: -55℃~+155℃
R12 R15 R28 = 1206W4F1000T5E_C17901: Type:Thick Film Resistors Resistance: Tolerance:±1% Tolerance:±1% Power(Watts): Overload Voltage (Max): Temperature Coefficient:±100ppm/℃ Temperature Coefficient:±100ppm/℃ Operating Temperature Range:-55℃~+155℃ Operating Temperature Range:-55℃~+155℃; LCSC Part Name: 100Ω ±1% 250mW 厚膜电阻; Supplier Part: C17901; Manufacturer: UNI-ROYAL(厚声); Manufacturer Part: 1206W4F1000T5E; Supplier Footprint: 1206; JLCPCB Part Class: Basic Part; Datasheet: https://atta.szlcsc.com/upload/public/pdf/source/20200306/C422600_1E6D84923E4A46A82E41ADD87F860B5C.pdf; Supplier: LCSC; Type: Thick Film Resistors; Tolerance: ±1%; Temperature Coefficient: ±100ppm/℃; Operating Temperature Range: -55℃~+155℃
R23 R31 R69 R71-R74 = 1206W4F1002T5E: Type:Thick Film Resistors Resistance:10kΩ Tolerance:±1% Tolerance:±1% Power(Watts): Overload Voltage (Max): Temperature Coefficient:±100ppm/℃ Temperature Coefficient:±100ppm/℃ Operating Temperature Range:-55℃~+155℃ Operating Temperature Range:-55℃~+155℃; LCSC Part Name: 10kΩ ±1% 250mW 厚膜电阻; Supplier Part: C17902; Manufacturer: UNI-ROYAL(厚声); Supplier Footprint: 1206; JLCPCB Part Class: Basic Part; Datasheet: https://atta.szlcsc.com/upload/public/pdf/source/20200306/C422600_1E6D84923E4A46A82E41ADD87F860B5C.pdf; Supplier: LCSC; Type: Thick Film Resistors; Tolerance: ±1%; Temperature Coefficient: ±100ppm/℃; Operating Temperature Range: -55℃~+155℃
R25 = 1206W4F4702T5E: Type:Thick Film Resistors Resistance:47kΩ Tolerance:±1% Tolerance:±1% Power(Watts): Overload Voltage (Max): Temperature Coefficient:±100ppm/℃ Temperature Coefficient:±100ppm/℃ Operating Temperature Range:-55℃~+155℃ Operating Temperature Range:-55℃~+155℃; LCSC Part Name: 47kΩ ±1% 250mW 厚膜电阻; Supplier Part: C25833; Manufacturer: UNI-ROYAL(厚声); Supplier Footprint: 1206; JLCPCB Part Class: Extended Part; Datasheet: https://atta.szlcsc.com/upload/public/pdf/source/20200306/C422600_1E6D84923E4A46A82E41ADD87F860B5C.pdf; Supplier: LCSC; Type: Thick Film Resistors; Tolerance: ±1%; Temperature Coefficient: ±100ppm/℃; Operating Temperature Range: -55℃~+155℃
R29 = 1206W4F1503T5E: Type:Thick Film Resistors Resistance:150kΩ Tolerance:±1% Tolerance:±1% Power(Watts): Overload Voltage (Max): Temperature Coefficient:±100ppm/℃ Temperature Coefficient:±100ppm/℃ Operating Temperature Range:-55℃~+155℃ Operating Temperature Range:-55℃~+155℃; LCSC Part Name: 150kΩ ±1% 250mW 厚膜电阻; Supplier Part: C17916; Manufacturer: UNI-ROYAL(厚声); Supplier Footprint: 1206; JLCPCB Part Class: Extended Part; Datasheet: https://atta.szlcsc.com/upload/public/pdf/source/20200306/C422600_1E6D84923E4A46A82E41ADD87F860B5C.pdf; Supplier: LCSC; Type: Thick Film Resistors; Tolerance: ±1%; Temperature Coefficient: ±100ppm/℃; Operating Temperature Range: -55℃~+155℃
R30 R64 R66 = 1206W4F2203T5E: Type:Thick Film Resistors Resistance:220kΩ Tolerance:±1% Tolerance:±1% Power(Watts): Overload Voltage (Max): Temperature Coefficient:±100ppm/℃ Temperature Coefficient:±100ppm/℃ Operating Temperature Range:-55℃~+155℃ Operating Temperature Range:-55℃~+155℃; LCSC Part Name: 220kΩ ±1% 250mW 厚膜电阻; Supplier Part: C17956; Manufacturer: UNI-ROYAL(厚声); Supplier Footprint: 1206; JLCPCB Part Class: Extended Part; Datasheet: https://atta.szlcsc.com/upload/public/pdf/source/20200306/C422600_1E6D84923E4A46A82E41ADD87F860B5C.pdf; Supplier: LCSC; Type: Thick Film Resistors; Tolerance: ±1%; Temperature Coefficient: ±100ppm/℃; Operating Temperature Range: -55℃~+155℃
R33 R56 R58 R68 = 1206W4J0202T5E: Type:Thick Film Resistors Resistance:2kΩ Tolerance:±5% Tolerance:±5% Power(Watts): Overload Voltage (Max): Temperature Coefficient:±100ppm/℃ Temperature Coefficient:±100ppm/℃ Operating Temperature Range:-55℃~+155℃ Operating Temperature Range:-55℃~+155℃; LCSC Part Name: 2kΩ ±5% 250mW 厚膜电阻; Supplier Part: C25657; Manufacturer: UNI-ROYAL(厚声); Supplier Footprint: 1206; JLCPCB Part Class: Extended Part; Datasheet: https://atta.szlcsc.com/upload/public/pdf/source/20200306/C422600_1E6D84923E4A46A82E41ADD87F860B5C.pdf; Supplier: LCSC; Type: Thick Film Resistors; Tolerance: ±5%; Temperature Coefficient: ±100ppm/℃; Operating Temperature Range: -55℃~+155℃
R50 R51 = 1206W4F3302T5E: Type:Thick Film Resistors Resistance:33kΩ Tolerance:±1% Tolerance:±1% Power(Watts): Overload Voltage (Max): Temperature Coefficient:±100ppm/℃ Temperature Coefficient:±100ppm/℃ Operating Temperature Range:-55℃~+155℃ Operating Temperature Range:-55℃~+155℃; LCSC Part Name: 33kΩ ±1% 250mW 厚膜电阻; Supplier Part: C18004; Manufacturer: UNI-ROYAL(厚声); Supplier Footprint: 1206; JLCPCB Part Class: Extended Part; Datasheet: https://atta.szlcsc.com/upload/public/pdf/source/20200306/C422600_1E6D84923E4A46A82E41ADD87F860B5C.pdf; Supplier: LCSC; Type: Thick Film Resistors; Tolerance: ±1%; Temperature Coefficient: ±100ppm/℃; Operating Temperature Range: -55℃~+155℃
R63 R65 = 1206W4F1003T5E: Type:Thick Film Resistors Resistance:100kΩ Tolerance:±1% Tolerance:±1% Power(Watts): Overload Voltage (Max): Temperature Coefficient:±100ppm/℃ Temperature Coefficient:±100ppm/℃ Operating Temperature Range:-55℃~+155℃ Operating Temperature Range:-55℃~+155℃; LCSC Part Name: 100kΩ ±1% 250mW 厚膜电阻; Supplier Part: C17900; Manufacturer: UNI-ROYAL(厚声); Supplier Footprint: 1206; JLCPCB Part Class: Basic Part; Datasheet: https://atta.szlcsc.com/upload/public/pdf/source/20200306/C422600_1E6D84923E4A46A82E41ADD87F860B5C.pdf; Supplier: LCSC; Type: Thick Film Resistors; Tolerance: ±1%; Temperature Coefficient: ±100ppm/℃; Operating Temperature Range: -55℃~+155℃
R79 R80 = 1206W4F2002T5E: Type:Thick Film Resistors Resistance:20kΩ Tolerance:±1% Tolerance:±1% Power(Watts): Overload Voltage (Max): Temperature Coefficient:±100ppm/℃ Temperature Coefficient:±100ppm/℃ Operating Temperature Range:-55℃~+155℃ Operating Temperature Range:-55℃~+155℃; LCSC Part Name: 20kΩ ±1% 250mW 厚膜电阻; Supplier Part: C18003; Manufacturer: UNI-ROYAL(厚声); Supplier Footprint: 1206; JLCPCB Part Class: Extended Part; Datasheet: https://atta.szlcsc.com/upload/public/pdf/source/20200306/C422600_1E6D84923E4A46A82E41ADD87F860B5C.pdf; Supplier: LCSC; Type: Thick Film Resistors; Tolerance: ±1%; Temperature Coefficient: ±100ppm/℃; Operating Temperature Range: -55℃~+155℃
R82 = 1206W4F1200T5E_C17909: Type:Thick Film Resistors Resistance: Tolerance:±1% Tolerance:±1% Power(Watts): Overload Voltage (Max): Temperature Coefficient:±100ppm/℃ Temperature Coefficient:±100ppm/℃ Operating Temperature Range:-55℃~+155℃ Operating Temperature Range:-55℃~+155℃; LCSC Part Name: 120Ω ±1% 250mW 厚膜电阻; Supplier Part: C17909; Manufacturer: UNI-ROYAL(厚声); Manufacturer Part: 1206W4F1200T5E; Supplier Footprint: 1206; JLCPCB Part Class: Basic Part; Datasheet: https://atta.szlcsc.com/upload/public/pdf/source/20200306/C422600_1E6D84923E4A46A82E41ADD87F860B5C.pdf; Supplier: LCSC; Type: Thick Film Resistors; Tolerance: ±1%; Temperature Coefficient: ±100ppm/℃; Operating Temperature Range: -55℃~+155℃
RJ1 = DS1133-S60BPX: Connector Type:RJReceptacle USOC Codes:RJ12 Number of Ports:1 Shielding:- LED:- Ratings:-; LCSC Part Name: RJ12; Supplier Part: C77859; Manufacturer: CONNFLY; Supplier Footprint: 插件; JLCPCB Part Class: Extended Part; Datasheet: https://atta.szlcsc.com/upload/public/pdf/source/20180529/C77859_3164FC81ACC4F2D8B15A2684EF7DB4A9.pdf; Supplier: LCSC; Connector Type: RJReceptacle; USOC Codes: RJ12; Number of Ports: 1
S1-S3 = K2-1102DP-X4SW-04: Contact Current:50mA Voltage Rating (DC):12V Insulation Resistance:100MΩ Circuit:SPST Mounting Sytle:Straight Actuator Style:Round Button With Lamp:- Operating Force:250gf@±30gf Mechanical Life:100000 Operating Temperature:-25℃~+85℃ Operating Temperature:; Supplier Part: C136671; Manufacturer: 韩国韩荣; Supplier Footprint: 6x6mm; JLCPCB Part Class: Extended Part; Datasheet: https://atta.szlcsc.com/upload/public/pdf/source/20210810/D0CD9D77408EACA829A5E533AC6E5B1E.pdf; Supplier: LCSC; Contact Current: 50mA; Voltage Rating (DC): 12V; Insulation Resistance: 100MΩ; Circuit: SPST; Mounting Sytle: Straight; Actuator Style: Round Button; Operating Force: 250gf@±30gf; Mechanical Life: 100000; Operating Temperature: -25℃~+85℃; Switch Length: 6mm; Switch Width: 6mm; Switch Height: 17mm
SJ.CANRX SJ.CANTX SJ.DCC1 SJ.Key SJ.LED6 SJ.LNet1 SJ.LNet2 SJ.noLogo SJ.SX1 SJ.SX2 = SJ-raily74: Pin Structure:1x2P Pitch:1.27mm Row Spacing:1.27mm Circluar Pins/Square Pins:Square Pins Mounting Type:- Number of Rows:Plugin Number of Pins:2P Current Rating (Max):1A Voltage Rating (Max):250V Length of Mating Pin:1.8mm Insulation Height:1mm Length of E; LCSC Part Name: 1x2P 间距:1.27mm 方针; Supplier Part: C2881569; Manufacturer: XKB Connection(中国星坤); Supplier Footprint: SMD,P=1.27mm(交错脚); JLCPCB Part Class: Extended Part; Supplier: LCSC; Pin Structure: 1x2P; Pitch: 1.27mm; Row Spacing: 1.27mm; Circluar Pins/Square Pins: Square Pins; Number of Rows: Plugin; Number of Pins: 2P; Current Rating (Max): 1A; Voltage Rating (Max): 250V; Length of Mating Pin: 1.8mm; Insulation Height: 1mm; Length of End Connection Pin: 4.2mm; Contact Plating: Gold; Operating Temperature Range: -40℃~+105℃; Soldering Temperature(Max): 260℃; Color: Black
SW1 = DS-09RP_C458083: Type:平拨,凸起式 Circuit:SPST Number of Positions:9Bit Lead Pitch:2.54mm Current Rating:25mA Voltage Rating:24V Operating Temperature:-20℃~+70℃ Operating Temperature:-20℃~+70℃ Operating Life:3千次 Color:Red; LCSC Part Name: 间距2.54mm 平拨,凸起式 9位拨码开关; Supplier Part: C458083; Manufacturer: 韩国韩荣; Supplier Footprint: 插件; JLCPCB Part Class: Extended Part; Datasheet: https://atta.szlcsc.com/upload/public/pdf/source/20210810/ECF2F28B1CE673E7F9581E27682BDB10.pdf; Supplier: LCSC; Type: 平拨,凸起式; Circuit: SPST; Number of Positions: 9Bit; Lead Pitch: 2.54mm; Current Rating: 25mA; Voltage Rating: 24V; Operating Temperature: -20℃~+70℃; Operating Life: 3千次; Color: Red
SX/DIN = DIN-504B-M10: Supplier: LCSC; Supplier Part: C2939346; Manufacturer: HOOYA(皓宇电子); JLCPCB Part Class: Extended Part; Supplier Footprint: 插件; Datasheet: https://atta.szlcsc.com/upload/public/pdf/source/20220120/ABB2570656C6359DBC61E5C1017AC323.pdf
SX/RJ45 = R-RJ45R08P-B000: Connector Type:RJ45Receptacle Number of Ports:1 Mounting Style:Right-Angle Shielding:有屏蔽 LED:不带LED Ratings:- Operating Temperature Range:0℃~+70℃ Operating Temperature Range:0℃~+70℃; LCSC Part Name: 弯插 不带LED; Supplier Part: C386756; Manufacturer: Ckmtw(灿科盟); Supplier Footprint: 插件; JLCPCB Part Class: Extended Part; Datasheet: https://atta.szlcsc.com/upload/public/pdf/source/20190508/C386756_CEA064C28A6A9ED64075DA45BB64214F.pdf; Supplier: LCSC; Connector Type: RJ45Receptacle; Number of Ports: 1; Mounting Style: Right-Angle; Shielding: 有屏蔽; LED: 不带LED; Operating Temperature Range: 0℃~+70℃
U8 = LC78_05-3.0: Input Voltage(DC):6.5V~28V Input Voltage(DC):6.5V~28V Output Voltage:5V Output Voltage:5V Output Power:15W Output Current (Max):3A Output Current (Max):3A Output Channel:1 Conversion Efficiency:92% Conversion Efficiency:92%; Supplier Part: C6078609; Manufacturer: GAPTEC; Supplier Footprint: SIP,11.6x7.5mm; JLCPCB Part Class: Extended Part; Datasheet: https://atta.szlcsc.com/upload/public/pdf/source/231023/LC78_3.0.pdf-fa208ee5ba32f8bbc1c8628948d637b2.pdf; Supplier: LCSC; Input Voltage(DC): 6.5V~28V; Output Voltage: 5V; Output Power: 15W; Output Current (Max): 3A; Output Channel: 1; Conversion Efficiency: 92%
U13 = max485ESA: Types:transceiver Supply Voltage:5V Supply Voltage:5V Data Rate:2.5Mbps Data Rate:2.5Mbps Driver/receiver:1/1 Node Number:32 ESD Protect:- ESD Protect:- Whether the isolation:NO Operating Temperature:0℃~+70℃ Operating Temperature:0℃~+70℃; LCSC Part Name: 5V供电 2.5Mbps 收发器; Supplier Part: C2687394; Manufacturer: JSMSEMI(杰盛微); Supplier Footprint: SOP-8; JLCPCB Part Class: Extended Part; Datasheet: https://atta.szlcsc.com/upload/public/pdf/source/20240105/50855C748597D944FF6C7C46E210B516.pdf; Supplier: LCSC; Types: transceiver; Supply Voltage: 5V; Data Rate: 2.5Mbps; Driver/receiver: 1/1; Node Number: 32; Whether the isolation: NO; Operating Temperature: 0℃~+70℃
U14 = ISO1050DUBR: Type:Transceiver；隔离器 Data Rate:1Mbps Supply Voltage:3V~5.5V Supply Voltage:3V~5.5V Operating Temperature:-55℃~+105℃ Operating Temperature:-55℃~+105℃; LCSC Part Name: 1Mbps 3V~5.5V; Supplier Part: C16428; Manufacturer: TI(德州仪器); Supplier Footprint: SOP-8; JLCPCB Part Class: Extended Part; Datasheet: https://www.ti.com/cn/lit/gpn/iso1050; Supplier: LCSC; Type: Transceiver；隔离器; Data Rate: 1Mbps; Supply Voltage: 3V~5.5V; Operating Temperature: -55℃~+105℃
U15 = 6N137S: Input Type:DC Supply Voltage:4.5V~5.5V；2.7V~3.6V Supply Voltage:4.5V~5.5V；2.7V~3.6V Isolation Voltage(rms):5kV Common Mode Transient Immunity (CMTI):- Data Rate:10Mbit/s Propagation Delay tpLH/tpHL:75ns；75ns Number of Channels:1 Operating Temperature:-55℃; LCSC Part Name: DC输入 1通道 隔离电压(rms):5000V; Supplier Part: C2918951; Manufacturer: Slkor(萨科微); Supplier Footprint: SOP-8-2.54mm; JLCPCB Part Class: Extended Part; Datasheet: https://atta.szlcsc.com/upload/public/pdf/source/20221025/B77DBF7347B36F1759FE2FF64F159AA9.pdf; Supplier: LCSC; Input Type: DC; Supply Voltage: 4.5V~5.5V；2.7V~3.6V; Isolation Voltage(rms): 5kV; Data Rate: 10Mbit/s; Propagation Delay tpLH/tpHL: 75ns；75ns; Number of Channels: 1; Operating Temperature: -55℃~+100℃
USB1 = KH-TYPE-C-2P: Connector Type:Type-C Standard:- Gender:- Number of Ports:- Number of Contacts:2P Mounting Style:- Current Rating - Power (Max):- Contact Material:- Contact Plating:- Operating Temperature Range:- Operating Temperature Range:-; LCSC Part Name: Type-C; Supplier Part: C2919656; Manufacturer: kinghelm(金航标); Supplier Footprint: 插件; JLCPCB Part Class: Extended Part; Datasheet: https://atta.szlcsc.com/upload/public/pdf/source/20220707/620587A9E0589B27D96D3CEE595CBC98.pdf; Supplier: LCSC; Connector Type: Type-C; Number of Contacts: 2P
WS2811 = WS2811: Type:- Input Voltage:- Input Voltage:- Switch Frequency:- Switch Frequency:- Channels:- Output Voltage:- Output Voltage:- Output Current:- Dimming:- Features:- Input Voltage(VAC):- Input Voltage(VAC):- Topology:- Operating temperature:- Operating temperat; Supplier Part: C114581; Manufacturer: worldsemi; Supplier Footprint: SOP-8; JLCPCB Part Class: Extended Part; Datasheet: https://atta.szlcsc.com/upload/public/pdf/source/20180423/C114581_D7EB4F7619FBAA371B1B7B79DFB248AC.pdf; Supplier: LCSC

## Nets
+3V3: C12.1 C18.2 C19.1 ESP32wroom.1(3V3) Q1.1(G) Q2.1(G) R2.2 R3.1 R4.1 R6.1 R59.1 R61.1 U14.1(VCC1) U16.8(VCC)
+5V: 0505S1.2(Vin) C11.2 C14.2 C16.1 C20.2 C22.2 D19.2(A) D22.2(A) D24.2(K) DC.1 ESP32wroom.19(5V) FH1.1 FH2.1 FH3.1 FH4.1 FH5.1 FH6.1 FH7.1 FH8.1 I2C1.3 KEY80.13 KEYBRD.3 KEYBRD_1.3 LED2.1(A) LED3.1(A) LED4.1(K) LM393N-L.8(VCC) MLL-Ring.1 R13.2 R14.1 R22.1 R23.2 R27.1 R50.2 R60.1 R62.1 R71.2 R72.1 R72.2 R73.2 R74.2 R79.2 R81.2 U8.3(+VOUT) U13.3(DE) U13.8(VCC) U15.8 USB1.1(VCC)
+12V: FH9.2 LED5.1(A) LEDs0.6 LEDs2.6 Out2.6 Out3.6 Out4.6 Out5.6 Out6.6 Out7.6
GND: 0505S1.1(GND) C7.1 C8.1 C9.2 C11.1 C12.2 C13.1 C14.1 C15.2 C16.2 C17.2 C18.1 C19.2 C20.1 C22.1 CN3.2 D24.1(A) DC.2 DC1.2 DC1.3 ESP32wroom.14(GND) ESP32wroom.20(GND) ESP32wroom.26(GND) I2C1.4 KEY80.14 KEYBRD.4 KEYBRD_1.2 KEYBRD_1.4 LED7.2(A) LEDs0.3 LEDs0.5 LEDs2.3 LEDs2.5 LM393N-L.4(GND) LM393N-L.5(INPUT 2+) LM393N-L.6(INPUT 2-) MLL-Ring.3 MLL-Ring.5 Out2.3 Out2.5 Out3.3 Out3.5 Out4.3 Out4.5 Out5.3 Out5.5 Out6.3 Out6.5 Out7.3 Out7.5 P1.2 Q4.2(E) R7.1 R24.1 R29.1 R33.1 R51.1 R56.1 R58.1 R64.1 R66.1 R68.1 R69.1 R80.1 RJ1.2 RJ1.5 S1.1 S1.2 S2.1 S2.2 S3.1 S3.2 SX/DIN.2 SX/RJ45.4 SX/RJ45.6 SX/RJ45.8 U8.2(GND) U13.5(GND) U14.4(GND1) U15.5 U16.4(GND) UH0.2 UH1.2 UH2.2 UH3.2 USB1.2(GND) WS2811.4(GND)
D4: ESP32wroom.32(IO4) H3.12 H3.14 H3.16 R67.2 R68.2 SJ.CANRX.2 SJ.LNet2.2 SJ.SX2.2 SW1.12(PIN12) SW1.14(PIN14) SW1.16(PIN16)
D5: ESP32wroom.29(IO5) H3.17 KEY80.5 SJ.CANTX.2 SW1.17(PIN16)
D13: ESP32wroom.15(IO13) H3.13 H3.15 H3.18 SJ.DCC1.2 SJ.LNet1.2 SJ.SX1.2 SW1.13(PIN13) SW1.15(PIN15) SW1.18(PIN16)
LED0: ESP32wroom.11(IO27) HB0.1
LED1: HB1.1
LED2: ESP32wroom.31(IO16) HB2.1
LED3: ESP32wroom.12(IO14) HB3.1
LED4: ESP32wroom.28(IO18) HB4.1
LED5: ESP32wroom.27(IO19) HB5.1 KEY80.7
LED6: DMX.2 ESP32wroom.21(IO23) KEY80.6 SJ.LED6.1
LED7: H3.10 HB7.1 MLL-Ring.4 SJ.noLogo.2 SW1.10(PIN10)
SCL: ESP32wroom.22(IO22) I2C1.2
SDA: ESP32wroom.25(IO21) I2C1.1
$1N1189: R8.2 U15.2
$1N1986: KEYBRD.2 KEYBRD_1.1 R15.1
$1N2750: KEY80.11 KEYBRD.1 R12.1
$1N3936: C8.2 H2.1 P1.1 R13.1
$1N11896: HB1.2 LEDs2.2
$1N11901: HB1.3 LEDs2.4
$1N11909: HB0.2 LEDs0.2
$1N11921: HB0.3 LEDs0.4
$1N12006: HB2.3 Out2.4
$1N12011: HB3.3 Out3.4
$1N12464: HB4.2 Out4.2
$1N12467: HB4.3 Out4.4
$1N12470: HB5.3 Out5.4
$1N12479: HB6.3 Out6.4
$1N12482: HB6.2 Out6.2
$1N12485: HB7.3 Out7.4
$1N12491: HB7.2 Out7.2
$1N18211: LED2.2(K) WS2811.2(OUTG)
$1N18215: LED3.2(K) WS2811.1(OUTR)
$1N18221: LED4.2(A) WS2811.3(OUTB)
$1N18270: D19.1(C) WS2811.8(VDD)
$1N18397: R28.1 WS2811.6(DIN)
$1N20798: D20.2(A) U15.3
$1N20802: D20.1(C) DCC1.2
$1N20805: DCC1.1 R8.1
$1N68632: 0505S1.4(Vo) C10.2 U14.8(VCC2)
$1N136278: H3.11 SJ.Key.2 SW1.11(PIN11)
$1N136334: H3.8 SJ.Key.1 SW1.8(PIN8)
$1N144385: ESP32wroom.7(IO32) R12.2
$1N144444: ESP32wroom.5(IO34) R55.2
$1N144530: KEY80.9 KEYBRD.7 KEYBRD_1.7 R7.2 R55.1 R56.2
$1N144710: ESP32wroom.4(VN) R57.2
$1N145450: C17.1 ESP32wroom.2(EN)
$1N145677: H2.3 KEYBRD.8 KEYBRD_1.5
$1N146501: KEYBRD.5 Q2.3(D) R62.2
$1N146581: C9.1 KEY80.12 R15.2 R27.2 R57.1 R58.2
$1N147646: H3.1 LED6.2(A) R2.1 SJ.DCC1.1 SW1.1(PIN1) U15.6
$1N147668: H3.2 SJ.CANTX.1 SW1.2(PIN2) U14.3(TXD)
$1N147689: H3.3 SJ.CANRX.1 SW1.3(PIN3) U14.2(RXD)
$1N147795: ESP32wroom.9(IO25) KEY80.4 S1.3 S1.4
$1N147805: ESP32wroom.13(IO12) KEY80.2 S3.3 S3.4
$1N147828: ESP32wroom.10(IO26) KEY80.3 S2.3 S2.4
$1N148307: ESP32wroom.8(IO33) Q1.2(S) R59.2
$1N148332: KEY80.10 KEYBRD.6 KEYBRD_1.6 Q1.3(D) R60.2
$1N148413: ESP32wroom.3(VP) R65.2
$1N148463: C7.2 KEYBRD_1.8 R14.2 R65.1 R66.2
$1N148528: ESP32wroom.6(IO35) R63.2
$1N148913: H2.2 R63.1 R64.2
$1N149088: ESP32wroom.33(IO0) R28.2
$1N149106: H3.9 MLL-Ring.2 SJ.noLogo.1 SW1.9(PIN9) WS2811.5(DO)
$1N150554: ESP32wroom.30(IO17) KEY80.1
$1N151576: D23.1(A) DC.3 DC1.1
$1N152061: C13.2 C15.1 D22.1(C) D23.2(K) FH9.1 U8.1(+VIN)
$1N152229: LED5.2(K) R69.2
$1N152627: CAN.3 CN1.3 D25.1 U14.7(CANH)
$1N152652: CAN.4 CN1.2 D25.2 U14.6(CANL)
$1N152720: 0505S1.3(0V) C10.1 CAN.2 CAN.5 CN1.1 D25.3 U14.5(GND2)
$1N154015: R5.2 SX/DIN.1 SX/RJ45.7
$1N154211: H3.7 R4.2 SJ.SX2.1 SW1.7(PIN7) U16.7(OUTPUT 2)
$1N154363: KEY80.8 R67.1
$1N154714: R74.1 U13.1(RO)
$1N154736: R73.1 U13.2(RE#)
$1N155057: LED6.1(K) R3.2
$1N155116: H3.6 R6.2 SJ.SX1.1 SW1.6(PIN6) U16.1(OUTPUT 1)
$1N156415: LM393N-L.1(OUTPUT 1) R22.2 R30.1 R34.1
$1N156473: H3.5 R33.2 R34.2 SJ.LNet2.1 SW1.5(PIN5)
$1N156685: Q4.1(B) R31.2
$1N161927: CN3.4 R79.1 R82.1 U13.6(A)
$1N166730: ESP32wroom.35(IO15) Q2.2(S) R61.2
$1N167301: FH8.2 Out7.1 UH3.3
$1N167305: FH7.2 Out6.1 UH3.1
$1N167326: FH2.2 LEDs2.1 UH0.3
$1N167330: FH1.2 LEDs0.1 UH0.1
$1N167491: DMX.3 R71.1 U13.4(DI)
$1N168063: LM393N-L.3(INPUT 1+) R25.1 R29.2 R30.2
$1N168112: LM393N-L.2(INPUT 1-) R23.1 R24.2
$1N168177: Q4.3(C) R25.2 RJ1.3 RJ1.4
$1N172997: DMX.1 HB6.1 SJ.LED6.2
$1N173930: ESP32wroom.34(IO2) H3.4 R31.1 SJ.LNet1.1 SW1.4(PIN4)
$1N174482: R50.1 R51.2 U16.2(INPUT 1-) U16.6(INPUT 2-)
